# Altium schematic sheet Connectors.SchDoc: Connectors
size Letter; Revision: 1.0; SheetNumber: 8; PageSetup: Record=PageOptions|CenterHorizontal=True|CenterVertical=True|PrintScale=1.00|XCorrection=1.00|YCorrection=1.00|PrintKind=1|BorderSize=5000000|LeftOffset=0|BottomOffset=0|Orientation=2|PaperLength=1000|PaperWidth=1000|Scale=100|PaperSource=7|PrintQuality=-3|MediaType=1|DitherType=10|PrintScaleMode=1|PaperKind=Letter|PaperIndex=1; ProjectTitle: Data Acquisition System
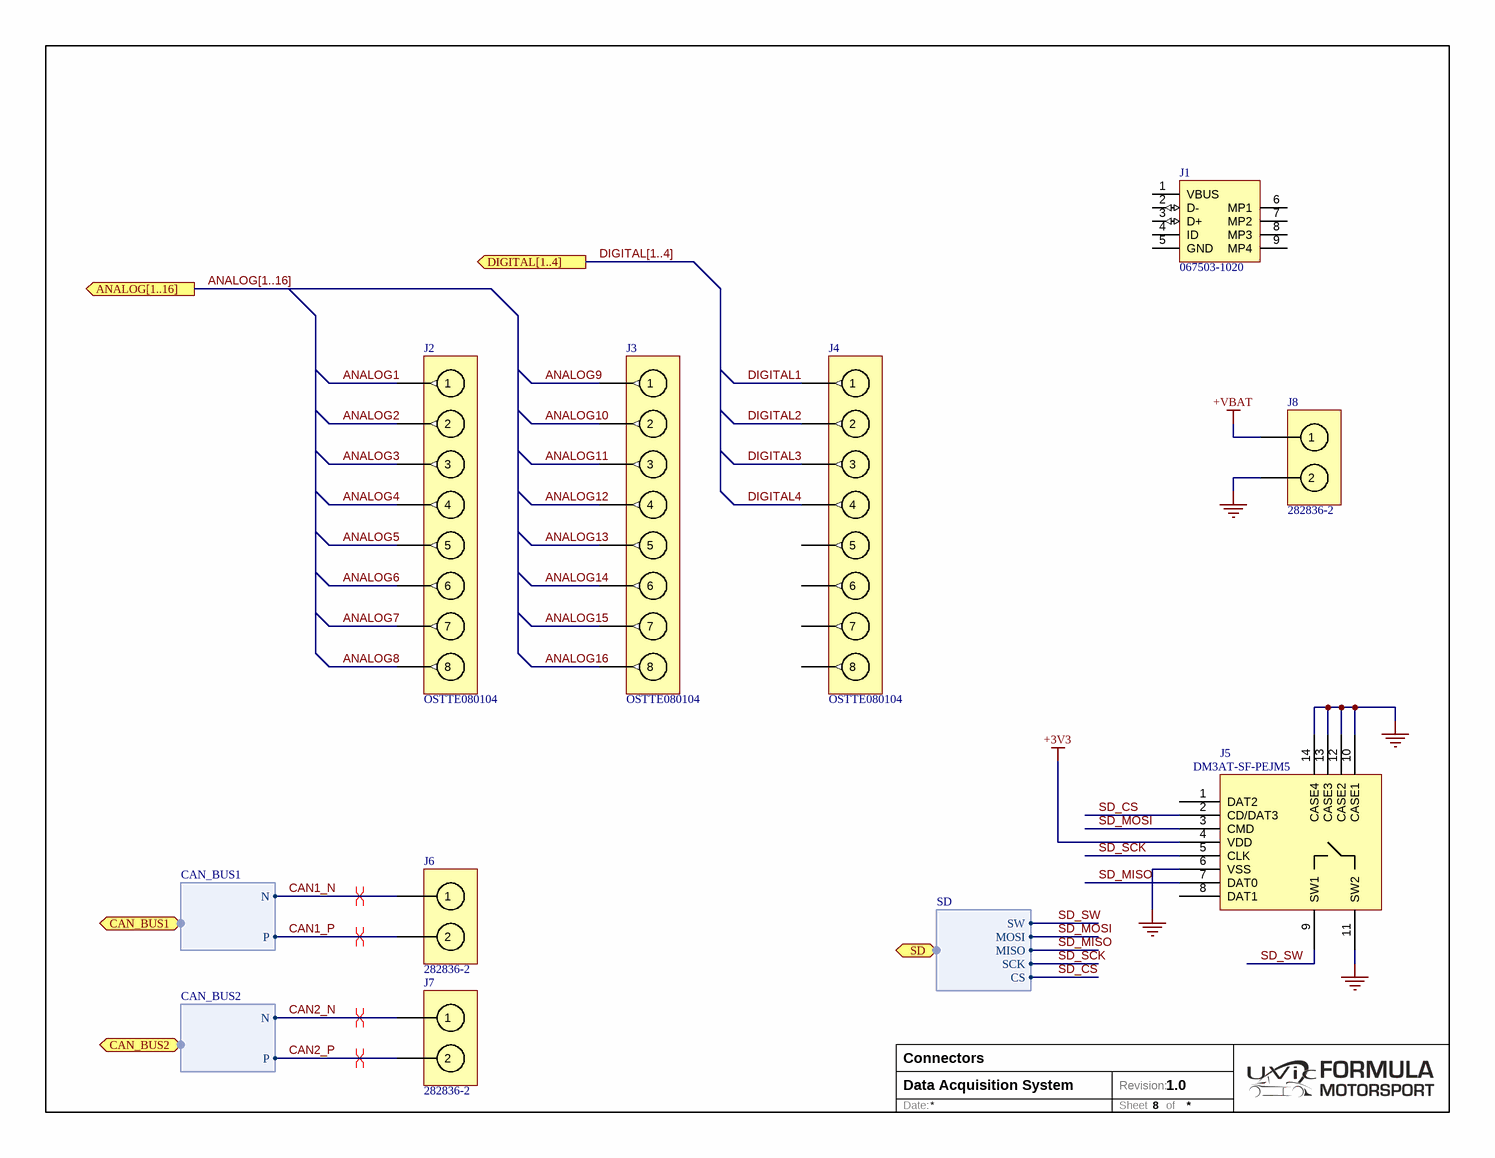
[diagram p0: Connectors.SchDoc]

## Parts
J1  067503-1020  [MOLX-67503-1020_V]
J2  OSTTE080104  [OSTTE0801x4]
J3  OSTTE080104  [OSTTE0801x4]
J4  OSTTE080104  [OSTTE0801x4]
J5  DM3AT-SF-PEJM5  [uSD_DM3AT]
J6  282836-2  [282836-2]
J7  282836-2  [282836-2]
J8  282836-2  [282836-2]

## Ports
ANALOG[1..16] (out), CAN_BUS1 (harness CAN_BUS1), CAN_BUS2 (harness CAN_BUS2), DIGITAL[1..4] (out), SD (harness SD)

## Harnesses
CAN_BUS1: N, P
CAN_BUS2: N, P
SD: MOSI, MISO, SCK, CS, SW

## Nets
+3V3: J5.4(VDD)
+VBAT: J8.1
GND: J5.6(VSS) J5.10(CASE1) J5.11(SW2) J5.12(CASE2) J5.13(CASE3) J5.14(CASE4) J8.2
ANALOG1: J2.1
ANALOG2: J2.2
ANALOG3: J2.3
ANALOG4: J2.4
ANALOG5: J2.5
ANALOG6: J2.6
ANALOG7: J2.7
ANALOG8: J2.8
ANALOG9: J3.1
ANALOG10: J3.2
ANALOG11: J3.3
ANALOG12: J3.4
ANALOG13: J3.5
ANALOG14: J3.6
ANALOG15: J3.7
ANALOG16: J3.8
CAN1_N: J6.1 ; port CAN_BUS1.N
CAN1_P: J6.2 ; port CAN_BUS1.P
CAN2_N: J7.1 ; port CAN_BUS2.N
CAN2_P: J7.2 ; port CAN_BUS2.P
DIGITAL1: J4.1
DIGITAL2: J4.2
DIGITAL3: J4.3
DIGITAL4: J4.4
SD_CS: J5.2(CD/DAT3) ; port SD.CS
SD_MISO: J5.7(DAT0) ; port SD.MISO
SD_MOSI: J5.3(CMD) ; port SD.MOSI
SD_SCK: J5.5(CLK) ; port SD.SCK
SD_SW: J5.9(SW1) ; port SD.SW

Not connected (* = marked no-connect by the designer): J1 1(VBUS) 2(D-) 3(D+) 4(ID) 5(GND) 6(MP1) 7(MP2) 8(MP3) 9(MP4); J4 5 6 7 8; J5 1(DAT2) 8(DAT1)

## Buses and harness runs
bus ANALOG[1..16] = port ANALOG[1..16]
bus DIGITAL[1..4] = port DIGITAL[1..4]

## Layout directives
differential pair: CAN1_N, CAN1_P, CAN2_N, CAN2_P

## Notes on the sheet
- Date:
- Revision:
- Sheet
- of

## Library data of the parts
J1 = 067503-1020: USB Mini-B; Supplier 1: Digi-Key; Supplier Part Number 1: WM5461CT-ND
J2-J4 = OSTTE0801x4: Terminal Block 8-pos; Supplier 1: Digi-Key; Supplier Part Number 1: ED2746-ND
J5 = DM3AT-SF-PEJM5: CONN MICRO SD R/A PUSH-PUSH SMD; Manufacturer: Hirose Electric Co Ltd; .Checked PCB: MM; Connector Type: Connector and Ejector; Card Type: Secure Digital - microSD TransFlash; Number of Positions: 10 (8 + 2); Insertion, Removal Method: Push In, Push Out; .Checked SCH: MM; Category: Connectors, Interconnects; Supplier Part Number: HR1964CT-ND; Family: Memory - PC Card Connectors; Manufacturer Part Number: DM3AT-SF-PEJM5; Price 1k [$]: 1.85200; Supplier: Digikey; Supplier 1: Digi-Key; Supplier Part Number 1: HR1964CT-ND; RoHS: RoHS Compliant; Stock 1: 7044; Pricing 1: 1=2.96, 10=2.457, 50=2.0476, 100=1.82, 250=1.5106, 500=1.365 (USD); Ejector Side: -; Mounting Type: Surface Mount, Right Angle; Features: Switch; Height Above Board: 0.066" (1.68mm); Mounting Feature: Normal, Standard - Top; Packaging: Cut Tape (CT); Contact Finish: Gold; Contact Finish Thickness: -; ComponentLink1URL: http://www.hirose.co.jp/cataloge_hp/e60900232.pdf; ComponentLink1Description: http://www.hirose.co.jp/cataloge_hp/e60900232.pdf
J6-J8 = 282836-2: Terminal Block 2-pos Side Entry 5mm; Supplier 1: Digi-Key; Supplier Part Number 1: A98076-ND